# Altium schematic sheet main.SchDoc
size A4
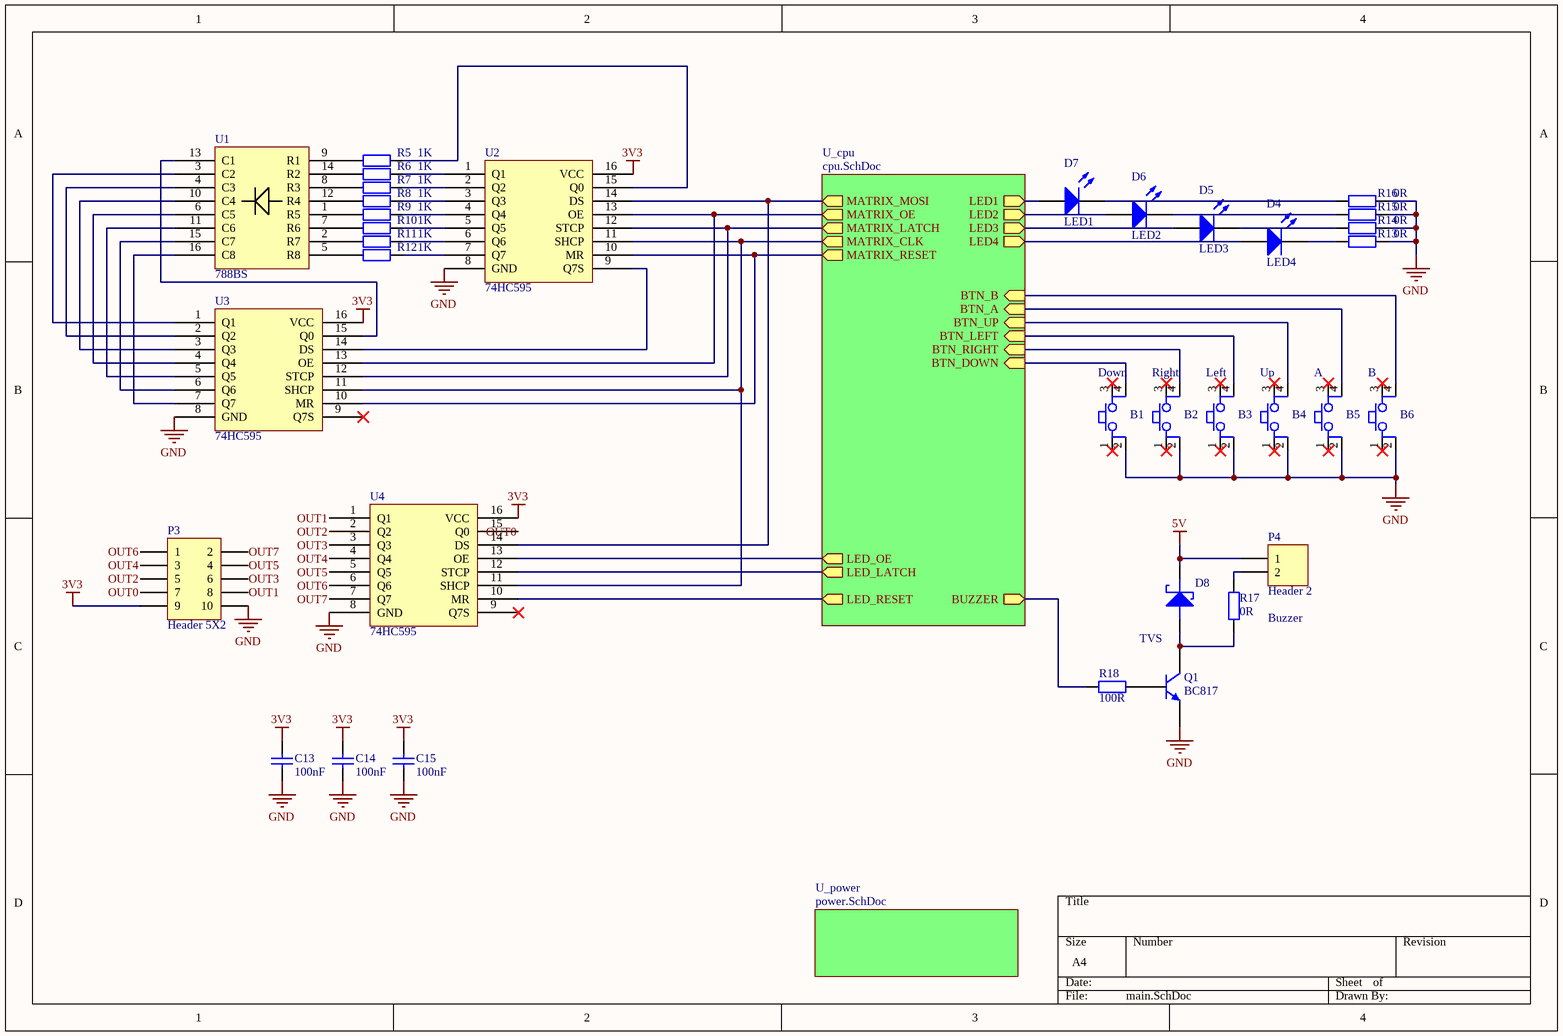
[diagram p0: main.SchDoc]

## Parts
B1  Down  [FP_BTN_SMD]
B2  Right  [FP_BTN_SMD]
B3  Left  [FP_BTN_SMD]
B4  Up  [FP_BTN_SMD]
B5  A  [FP_BTN_SMD]
B6  B  [FP_BTN_SMD]
C13  100nF  [FP_0805_CAP_085]
C14  100nF  [FP_0805_CAP_085]
C15  100nF  [FP_0805_CAP_085]
D4  LED4  [FP_0805_LED_RED]
D5  LED3  [FP_0805_LED_RED]
D6  LED2  [FP_0805_LED_RED]
D7  LED1  [FP_0805_LED_RED]
D8  TVS  [FP_SMB]
P3  Header 5X2  [HEADER-2X5]
P4  Header 2  [HDR1X2]
Q1  BC817  [FP_SOT23-3]
R5  1K  [FP_0805_RES]
R6  1K  [FP_0805_RES]
R7  1K  [FP_0805_RES]
R8  1K  [FP_0805_RES]
R9  1K  [FP_0805_RES]
R10  1K  [FP_0805_RES]
R11  1K  [FP_0805_RES]
R12  1K  [FP_0805_RES]
R13  0R  [FP_0805_RES]
R14  0R  [FP_0805_RES]
R15  0R  [FP_0805_RES]
R16  0R  [FP_0805_RES]
R17  0R  [FP_0805_RES]
R18  100R  [FP_0805_RES]
U1  788BS  [788BS]
U2  74HC595  [TSSOP16]
U3  74HC595  [TSSOP16]
U4  74HC595  [TSSOP16]

## Sub-sheets
U_cpu = cpu.SchDoc: MATRIX_MOSI (out), MATRIX_LATCH (out), MATRIX_CLK (out), MATRIX_OE (out), MATRIX_RESET (out), BTN_UP (in), BTN_DOWN (in), BTN_LEFT (in), BTN_RIGHT (in), BTN_A (in), BTN_B (in), LED_LATCH (out), LED_OE (out), LED_RESET (out), LED1 (out), LED2 (out), LED3 (out), LED4 (out), BUZZER (out)
U_power = power.SchDoc: no entries

## Nets
3V3: C13.2 C14.2 C15.2 P3.9 U2.16(VCC) U3.16(VCC) U4.16(VCC)
5V: D8.1(CATHODE) P4.1
GND: B1.2 B2.2 B3.2 B4.2 B5.2 B6.2 C13.1 C14.1 C15.1 P3.10 Q1.2(E) R13.2 R14.2 R15.2 R16.2 U2.8(GND) U3.8(GND) U4.8(GND)
OUT0: P3.7 U4.15(Q0)
OUT1: P3.8 U4.1(Q1)
OUT2: P3.5 U4.2(Q2)
OUT3: P3.6 U4.3(Q3)
OUT4: P3.3 U4.4(Q4)
OUT5: P3.4 U4.5(Q5)
OUT6: P3.1 U4.6(Q6)
OUT7: P3.2 U4.7(Q7)
NetB1_4: B1.4 ; sheet U_cpu/BTN_DOWN
NetB2_4: B2.4 ; sheet U_cpu/BTN_RIGHT
NetB3_4: B3.4 ; sheet U_cpu/BTN_LEFT
NetB4_4: B4.4 ; sheet U_cpu/BTN_UP
NetB5_4: B5.4 ; sheet U_cpu/BTN_A
NetB6_4: B6.4 ; sheet U_cpu/BTN_B
NetD4_1: D4.1(A) ; sheet U_cpu/LED4
NetD4_2: D4.2(K) R13.1
NetD5_1: D5.1(A) ; sheet U_cpu/LED3
NetD5_2: D5.2(K) R14.1
NetD6_1: D6.1(A) ; sheet U_cpu/LED2
NetD6_2: D6.2(K) R15.1
NetD7_1: D7.1(A) ; sheet U_cpu/LED1
NetD7_2: D7.2(K) R16.1
NetD8_2: D8.2(ANODE) Q1.3(C) R17.1
NetP4_2: P4.2 R17.2
NetQ1_1: Q1.1(B) R18.2
NetR5_1: R5.1 U2.15(Q0)
NetR5_2: R5.2 U1.9(R1)
NetR6_1: R6.1 U2.1(Q1)
NetR6_2: R6.2 U1.14(R2)
NetR7_1: R7.1 U2.2(Q2)
NetR7_2: R7.2 U1.8(R3)
NetR8_1: R8.1 U2.3(Q3)
NetR8_2: R8.2 U1.12(R4)
NetR9_1: R9.1 U2.4(Q4)
NetR9_2: R9.2 U1.1(R5)
NetR10_1: R10.1 U2.5(Q5)
NetR10_2: R10.2 U1.7(R6)
NetR11_1: R11.1 U2.6(Q6)
NetR11_2: R11.2 U1.2(R7)
NetR12_1: R12.1 U2.7(Q7)
NetR12_2: R12.2 U1.5(R8)
NetR18_1: R18.1 ; sheet U_cpu/BUZZER
NetU1_3: U1.3(C2) U3.1(Q1)
NetU1_4: U1.4(C3) U3.2(Q2)
NetU1_6: U1.6(C5) U3.4(Q4)
NetU1_10: U1.10(C4) U3.3(Q3)
NetU1_11: U1.11(C6) U3.5(Q5)
NetU1_13: U1.13(C1) U3.15(Q0)
NetU1_15: U1.15(C7) U3.6(Q6)
NetU1_16: U1.16(C8) U3.7(Q7)
NetU2_9: U2.9(Q7S) U3.14(DS)
NetU2_10: U2.10(MR) U3.10(MR) ; sheet U_cpu/MATRIX_RESET
NetU2_11: U2.11(SHCP) U3.11(SHCP) U4.11(SHCP) ; sheet U_cpu/MATRIX_CLK
NetU2_12: U2.12(STCP) U3.12(STCP) ; sheet U_cpu/MATRIX_LATCH
NetU2_13: U2.13(OE) U3.13(OE) ; sheet U_cpu/MATRIX_OE
NetU2_14: U2.14(DS) U4.14(DS) ; sheet U_cpu/MATRIX_MOSI
NetU4_10: U4.10(MR) ; sheet U_cpu/LED_RESET
NetU4_12: U4.12(STCP) ; sheet U_cpu/LED_LATCH
NetU4_13: U4.13(OE) ; sheet U_cpu/LED_OE

Not connected (* = marked no-connect by the designer): B1 1* 3*; B2 1* 3*; B3 1* 3*; B4 1* 3*; B5 1* 3*; B6 1* 3*; U3 9(Q7S)*; U4 9(Q7S)*

## Notes on the sheet
- Buzzer

## Library data of the parts
B1-B6 = Button 4P: Push button; Name: TACT 6x 6 4P SPST 1 FSM2JSMA (TYC) 50mA 12VDC SMD; Reference: 45-05-42; Supplier: Lomex
C13-C15 = CAP 100nF: Capacitor; Voltage: 50V; Name: 100nF 0805 10% 50V X7R 0805B104K500CT (WAL); Supplier: Lomex; Reference: 82-10-76; Value: 100nF
D4-D7 = LED: Typical RED GaAs LED; pin to pad: 1>A 2>K; Name: LED - 2012 RED 630nm 140mcd HL-PSC-2012S9AC; Supplier: Lomex; Reference: 95-03-83
D8 = SCHOTTKY: TVS diode; Name: 6.7V Ubr 400W UNIDIR. 5V Urwm SMAJ5.0A (LFS) DO-214AC (SMA) ˝AE˝; Supplier: Lomex; Reference: 96-00-75
P3 = Header 5X2: Header, 5-Pin, Dual row; LatestRevisionDate: 17-Jul-2002; LatestRevisionNote: Re-released for DXP Platform.; Publisher: Altium Limited
P4 = Header 2: Header, 2-Pin; Name: Pin header 90° (2); LatestRevisionDate: 17-Jul-2002; LatestRevisionNote: Re-released for DXP Platform.; Publisher: Altium Limited
Q1 = BC817: NPN General-purpose Transistor; Reference: 3020948; Name: Bipolar (BJT) Single Transistor, NPN; ComponentLink1Description: Manufacturer Link; ComponentLink1URL: http://www.semiconductors.philips.com/; ComponentLink2Description: Datasheet; ComponentLink2URL: http://www.semiconductors.philips.com/acrobat/datasheets/BC817_BC817W_BC337_5.pdf; Supplier: Farnell
R5-R12 = RES: Resistor; Name: 1K00 0805 5% RC0805JR-101KL 0.125W (YAG); Supplier: Lomex; Reference: 81-34-72; Value: 1K
R13-R16 = RES: Resistor; Name: LED resistor; Value: 0R
R17 = RES: Resistor; Name: Buzzer resistor; Value: 0R
R18 = RES: Resistor; Name: 100R 0805 5% RC0805JR-10100RL; Supplier: Lomex; Reference: 81-34-71; Value: 100R
U1 = 788BS: LED Matrix [8x8]; Name: LED matrix
U2-U4 = 74HC595: Shift register [8]; Reference: 1607848; Name: Shift Register, HC Family, 74HC595, Serial to Parallel, Serial to Serial; Supplier: Farnell